# EAGLE design enc_read (EAGLE 9.5.2)
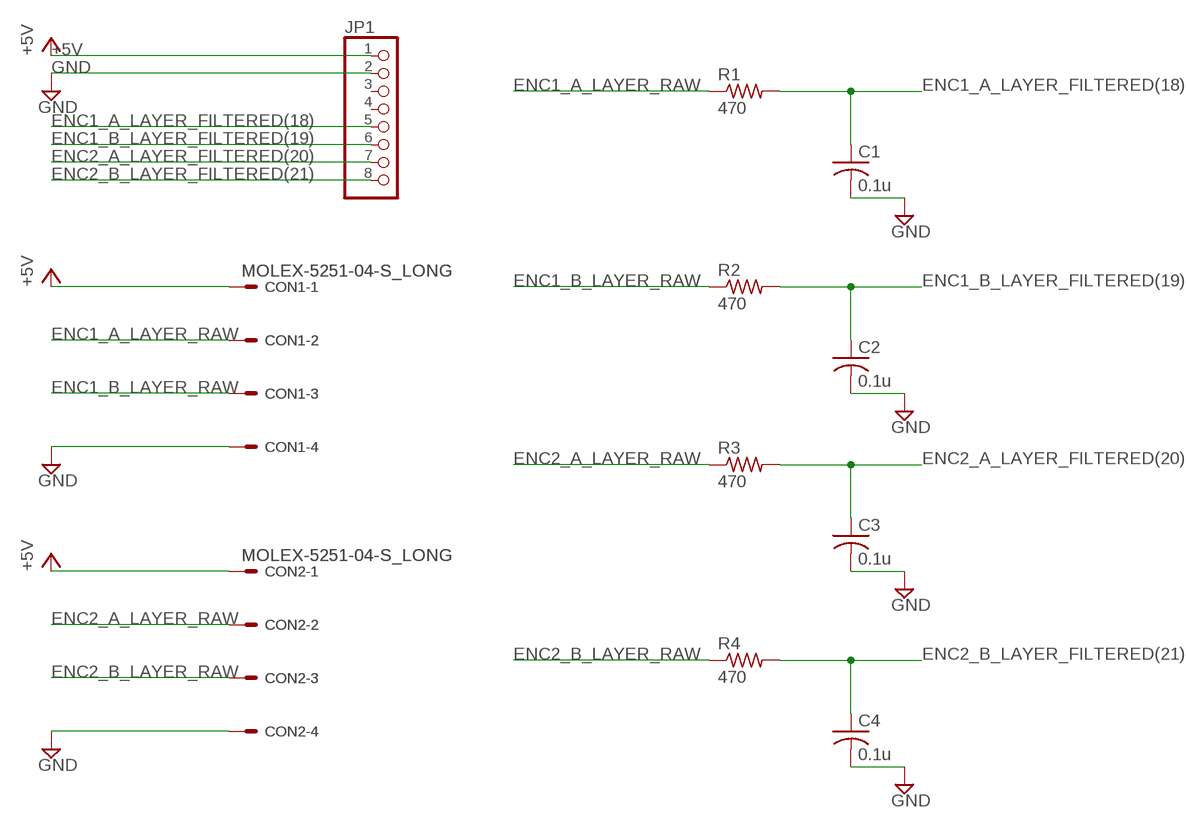
[diagram p0: schematic, sheet 1]

## Parts
C1  0.1u  C-2012  [2012-C]
C2  0.1u  C-2012  [2012-C]
C3  0.1u  C-2012  [2012-C]
C4  0.1u  C-2012  [2012-C]
CON1  MOLEX-5251-04-S_LONG  [5251-04-S_LONG]
CON2  MOLEX-5251-04-S_LONG  [5251-04-S_LONG]
JP1  PINHD-1X8  [1X08]
R1  470  R-2012  [2012-R]
R2  470  R-2012  [2012-R]
R3  470  R-2012  [2012-R]
R4  470  R-2012  [2012-R]

## Nets
+5V: CON1.1 CON2.1 JP1.1
ENC1_A_LAYER_FILTERED(18): C1.1 JP1.5 R1.2
ENC1_A_LAYER_RAW: CON1.2 R1.1
ENC1_B_LAYER_FILTERED(19): C2.1 JP1.6 R2.2
ENC1_B_LAYER_RAW: CON1.3 R2.1
ENC2_A_LAYER_FILTERED(20): C3.1 JP1.7 R3.2
ENC2_A_LAYER_RAW: CON2.2 R3.1
ENC2_B_LAYER_FILTERED(21): C4.1 JP1.8 R4.2
ENC2_B_LAYER_RAW: CON2.3 R4.1
GND: C1.2 C2.2 C3.2 C4.2 CON1.4 CON2.4 JP1.2
Unconnected: JP1.3 JP1.4

## Library data of the parts
C1-C4 = Passive_Robotech:C
CON1 CON2 = Connector_Robotech:MOLEX-5251-04: CONNECTOR Molex 5251 4-pin wire to board 2.54 mm (.1 inch) pitch header
JP1 = Connector_Robotech:PINHD-1X8: PIN HEADER
R1-R4 = Passive_Robotech:R

## Board
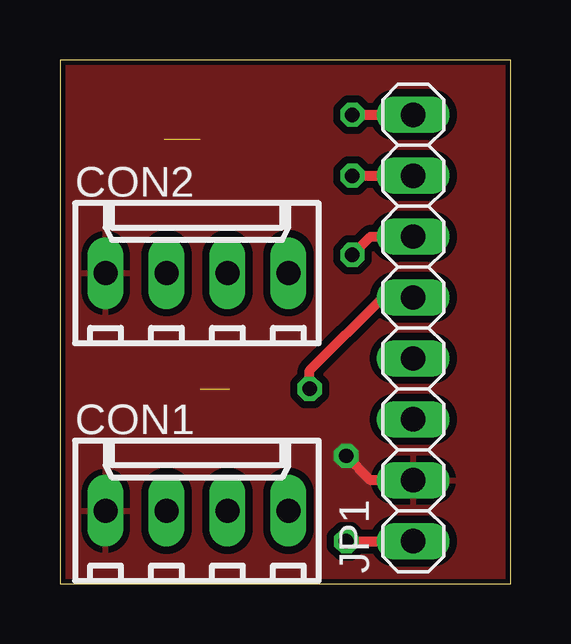
[diagram p1: board, top side]
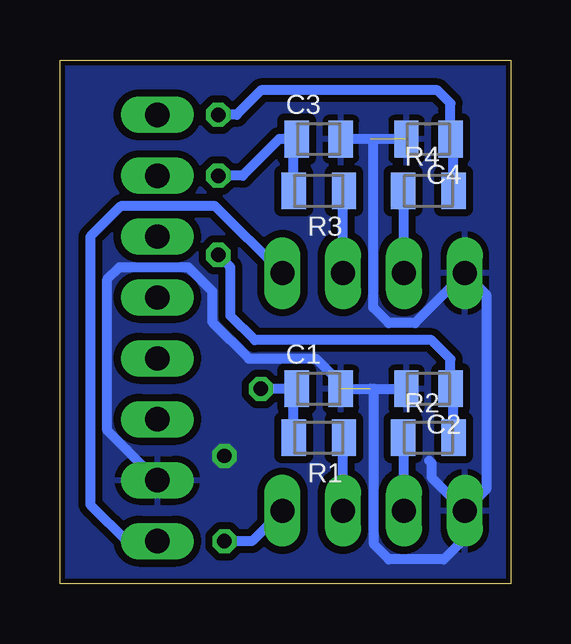
[diagram p2: board, bottom side, seen from below]

Size 18.8 x 21.84 mm. Coordinates in mm from the lower left corner, seen from the top.
Outline: 0,0 18.8,0 18.8,21.84 0,21.84 0,0
Copper layers (1*16): Top 0.0356mm / dielectric 1.5011mm / Bottom 0.0356mm
Design rules "formita": minimum track width 10mil, minimum drill 0.5994mm, track to track 0.3mm, track to pad 0.3mm, pad to pad 0.3mm, via to via 0.3mm, smd to smd 8mil, copper to edge 8mil, drill to drill 8mil, minimum pad ring 10mil, minimum via ring 8mil, stop-mask expansion 4mil, vias tented up to drill 1mm, thermal gap 10mil

### Footprints (pad centres in the part's own frame; a part is rotated, then mirrored left to right if it is on the bottom)
2012-C = smd 1.016 x 1.524: 1 -0.921,0; 2 0.921,0
5251-04-S_LONG = drill 1 long: 1 3.81,0; 2 1.27,0; 3 -1.27,0; 4 -3.81,0
1X08 = drill 1.016 long: 1 -8.89,0; 2 -6.35,0; 3 -3.81,0; 4 -1.27,0; 5 1.27,0; 6 3.81,0; 7 6.35,0; 8 8.89,0
2012-R = smd 1.016 x 1.524: 1 -1.048,0; 2 1.048,0

### Placement (x,y rotation side)
C1  8,8.13 0 bottom
C2  3.43,8.13 180 bottom
C3  8,18.54 0 bottom
C4  3.43,18.54 180 bottom
CON1  5.71,3.05 0 top
CON2  5.71,12.95 0 top
JP1  14.73,10.67 90 top
R1  8,6.1 180 bottom
R2  3.43,6.1 0 bottom
R3  8,16.38 180 bottom
R4  3.43,16.38 0 bottom

### Tracks (layer width: path | path; a pad name or v marks a point on that pad's centre or on a via)
+5V  (via drill 0.6)
  Top 0.406: v11.94,1.78 JP1.1
  Bottom 0.406: CON1.1 10.79,1.78 v11.94,1.78 | CON2.1 12.32,15.75 16.26,15.75 17.53,14.48 17.53,3.3 16,1.78 JP1.1
ENC1_A_LAYER_FILTERED(18)  (via drill 0.6)
  Top 0.406: v10.41,8.13 10.41,8.89 13.46,11.94 JP1.5
  Bottom 0.406: v10.41,8.13 C1.1 9.05,8 R1.2
ENC1_A_LAYER_RAW
  Bottom 0.406: CON1.2 6.99,6.06 R1.1
ENC1_B_LAYER_FILTERED(19)  (via drill 0.6)
  Top 0.406: v12.19,13.72 12.95,14.48 JP1.6
  Bottom 0.406: R2.2 2.38,8 C2.1 2.51,9.37 3.3,10.16 10.67,10.16 11.68,11.18 11.68,13.21 v12.19,13.72
ENC1_B_LAYER_RAW
  Bottom 0.406: CON1.3 4.45,6.06 R2.1
ENC2_A_LAYER_FILTERED(20)  (via drill 0.6)
  Top 0.406: v12.19,17.02 JP1.7
  Bottom 0.406: R3.2 9.05,18.41 C3.1 9.65,18.54 11.18,17.02 v12.19,17.02
ENC2_A_LAYER_RAW
  Bottom 0.406: CON2.2 6.99,16.35 R3.1
ENC2_B_LAYER_FILTERED(21)  (via drill 0.6)
  Top 0.406: v12.19,19.56 JP1.8
  Bottom 0.406: R4.2 2.38,18.41 C4.1 2.51,20.03 3.05,20.57 10.41,20.57 11.43,19.56 v12.19,19.56
ENC2_B_LAYER_RAW
  Bottom 0.406: CON2.3 4.45,16.35 R4.1
GND  (via drill 0.6)  (2 unrouted)
  Top 0.406: JP1.2 12.95,4.32 v11.94,5.33
  Bottom 0.406: C4.2 5.73,18.54 5.73,11.51 5.08,10.87 3.99,10.87 CON2.4 1.02,12.06 1.02,3.94 CON1.4 | 5.84,18.54 C3.2 | CON1.4 1.91,1.91 2.79,1.02 5.08,1.02 5.7,1.64 5.7,8.13 6.86,8.13 | 5.84,8.13 C2.2 4.35,7.99 | C1.2 6.86,8.13 | 3.39,5.13 3.3,5.04 3.3,4.45 CON1.4 | JP1.2 16.01,5.59 16.02,5.59 16.82,6.39 16.82,12.7 16.31,13.21 13.45,13.21 12.45,12.2 12.45,10.92 10.92,9.39 8.12,9.39 6.86,8.13
  pour Bottom: 18.8,21.84 18.8,0 0,0 0,21.84
  pour Top: 0,21.84 0,0 18.8,0 18.8,21.84